# Altium schematic sheet [05]_Control Panel Items Sheet.SchDoc
size 508 x 279 mm; DocumentNumber: 5; SheetNumber: 5; SheetTotal: 5
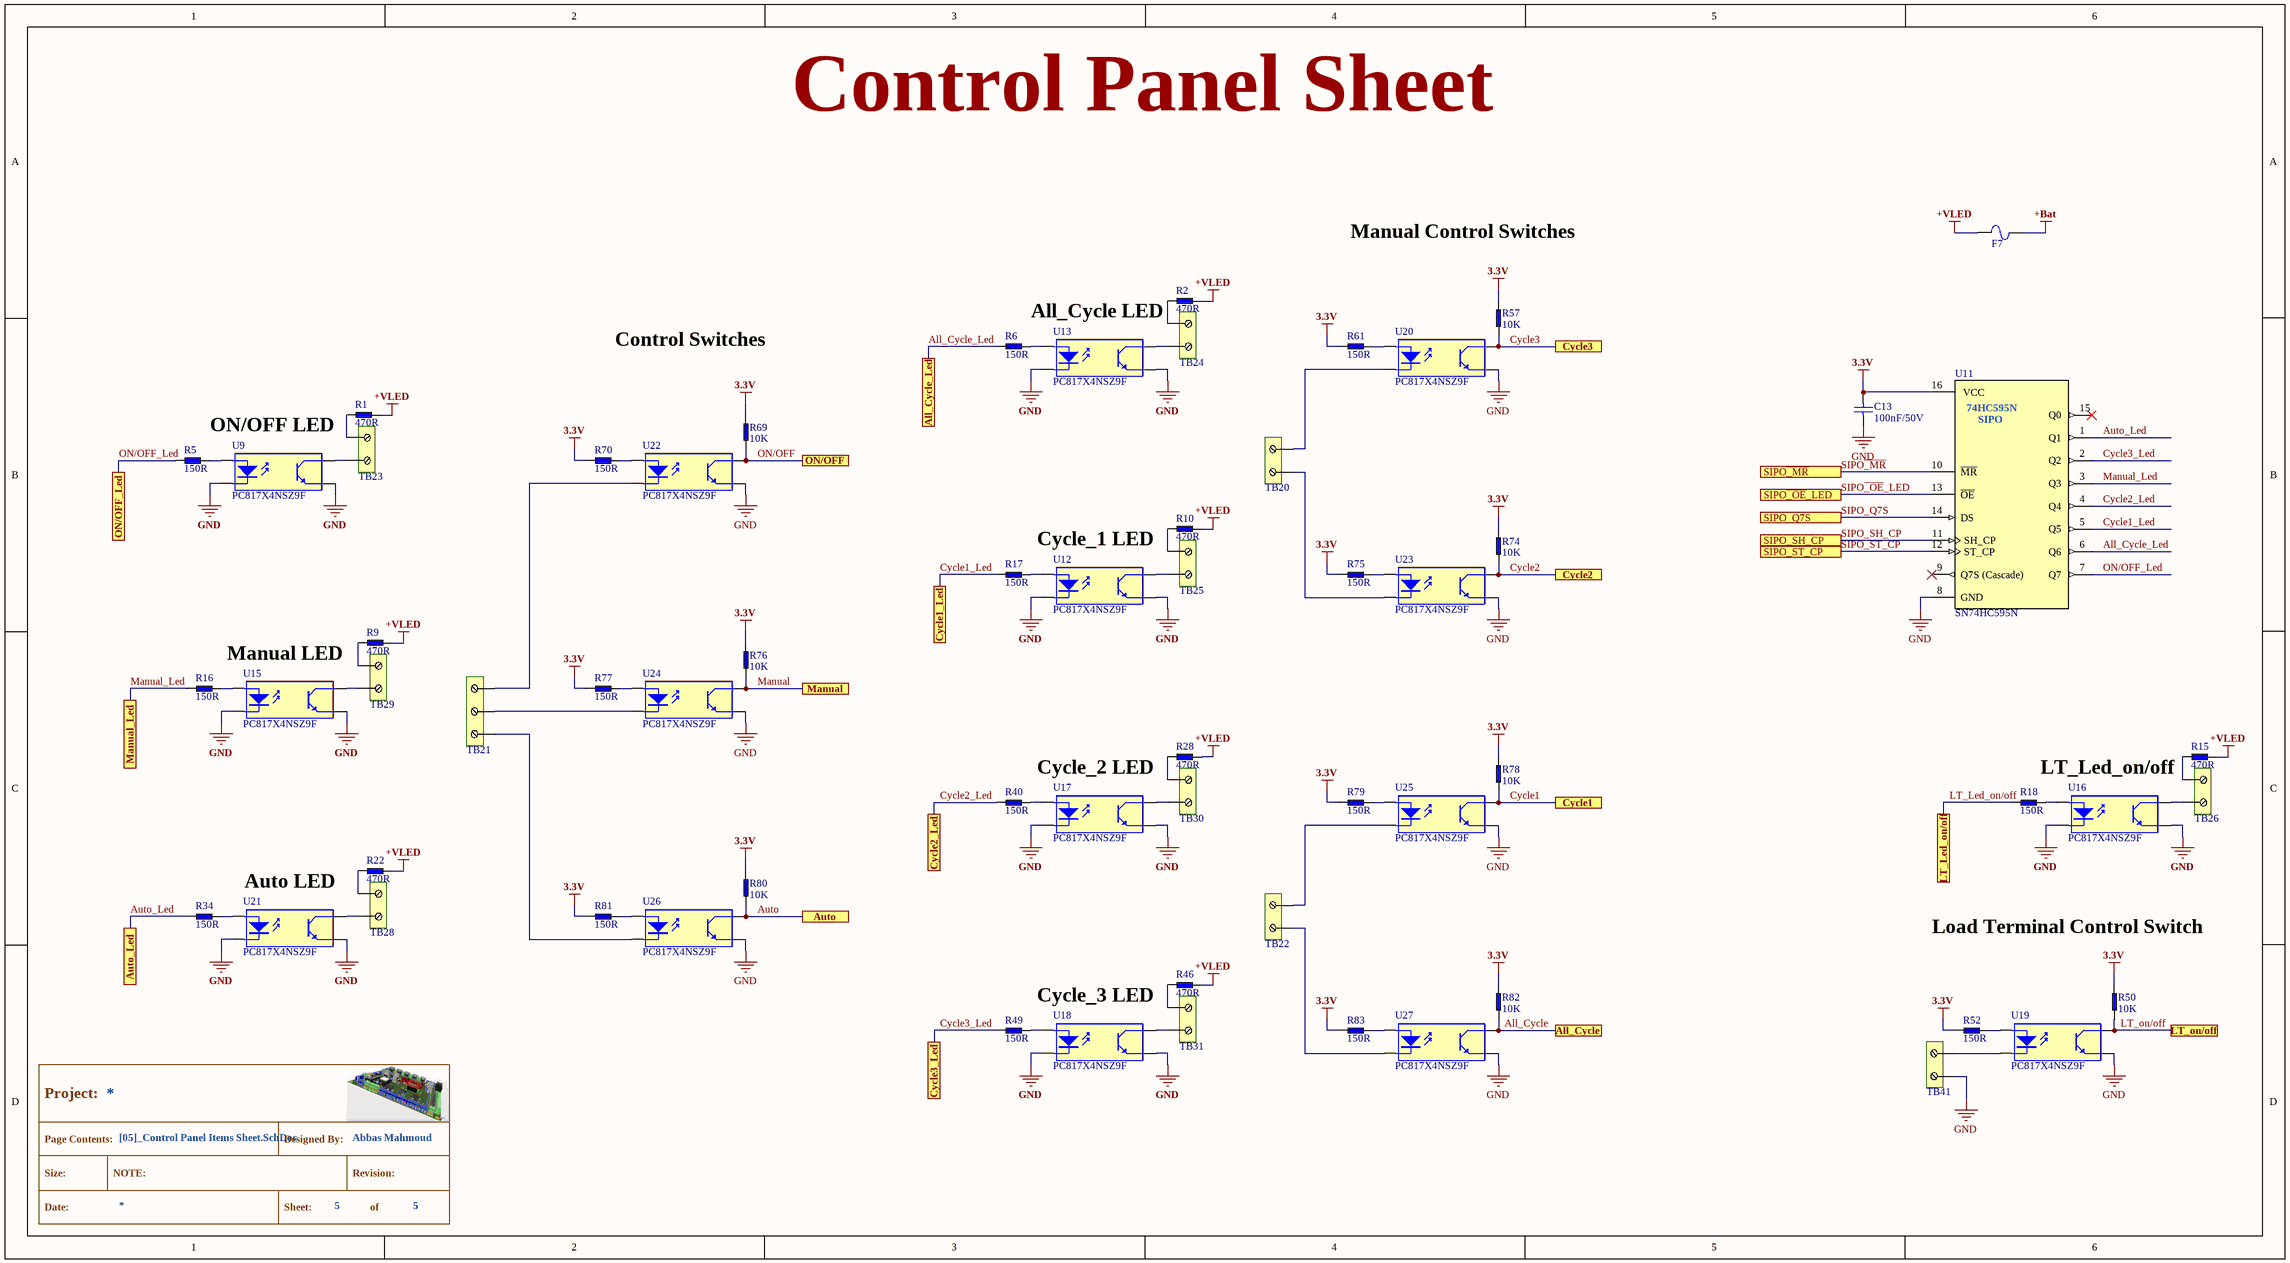
[diagram p0: [05]_Control Panel Items Sheet.SchDoc]

## Parts
*  Title Block  (value not drawn)  (graphical)
C13  100nF/50V  [CCAP - PACKAGE - THT ,P = 2.54 MM]
F7  FUSES&HOLDERS  [FUSE-BLX-A HOLDER]  (value not drawn)
R1  470R  [R - THT - P5.0 - 1/4W]
R2  470R  [R - THT - P5.0 - 1/4W]
R5  150R  [R - THT - P5.0 - 1/4W]
R6  150R  [R - THT - P5.0 - 1/4W]
R9  470R  [R - THT - P5.0 - 1/4W]
R10  470R  [R - THT - P5.0 - 1/4W]
R15  470R  [R - THT - P5.0 - 1/4W]
R16  150R  [R - THT - P5.0 - 1/4W]
R17  150R  [R - THT - P5.0 - 1/4W]
R18  150R  [R - THT - P5.0 - 1/4W]
R22  470R  [R - THT - P5.0 - 1/4W]
R28  470R  [R - THT - P5.0 - 1/4W]
R34  150R  [R - THT - P5.0 - 1/4W]
R40  150R  [R - THT - P5.0 - 1/4W]
R46  470R  [R - THT - P5.0 - 1/4W]
R49  150R  [R - THT - P5.0 - 1/4W]
R50  10K  [R - THT - P5.0 - 1/4W]
R52  150R  [R - THT - P5.0 - 1/4W]
R57  10K  [R - THT - P5.0 - 1/4W]
R61  150R  [R - THT - P5.0 - 1/4W]
R69  10K  [R - THT - P5.0 - 1/4W]
R70  150R  [R - THT - P5.0 - 1/4W]
R74  10K  [R - THT - P5.0 - 1/4W]
R75  150R  [R - THT - P5.0 - 1/4W]
R76  10K  [R - THT - P5.0 - 1/4W]
R77  150R  [R - THT - P5.0 - 1/4W]
R78  10K  [R - THT - P5.0 - 1/4W]
R79  150R  [R - THT - P5.0 - 1/4W]
R80  10K  [R - THT - P5.0 - 1/4W]
R81  150R  [R - THT - P5.0 - 1/4W]
R82  10K  [R - THT - P5.0 - 1/4W]
R83  150R  [R - THT - P5.0 - 1/4W]
TB20  2 Pins Pluggable  [TERMINAL BLOCK - 2 PINS - PACKAGE - PLUGGABLE - THT - P = 5.08MM - Horizontal _ Plug+Receptable]  (value not drawn)
TB21  3 Pins Pluggable  [TERMINAL BLOCK - 3 PINS - PACKAGE - PLUGGABLE - THT - P = 5.08MM - HORIZONTAL _ PLUG+RECEPTABLE]  (value not drawn)
TB22  2 Pins Pluggable  [TERMINAL BLOCK - 2 PINS - PACKAGE - PLUGGABLE - THT - P = 5.08MM - Horizontal _ Plug+Receptable]  (value not drawn)
TB23  2 Pins Pluggable  [TERMINAL BLOCK - 2 PINS - PACKAGE - PLUGGABLE - THT - P = 5.08MM - Horizontal _ Plug+Receptable]  (value not drawn)
TB24  2 Pins Pluggable  [TERMINAL BLOCK - 2 PINS - PACKAGE - PLUGGABLE - THT - P = 5.08MM - Horizontal _ Plug+Receptable]  (value not drawn)
TB25  2 Pins Pluggable  [TERMINAL BLOCK - 2 PINS - PACKAGE - PLUGGABLE - THT - P = 5.08MM - Horizontal _ Plug+Receptable]  (value not drawn)
TB26  2 Pins Pluggable  [TERMINAL BLOCK - 2 PINS - PACKAGE - PLUGGABLE - THT - P = 5.08MM - Horizontal _ Plug+Receptable]  (value not drawn)
TB28  2 Pins Pluggable  [TERMINAL BLOCK - 2 PINS - PACKAGE - PLUGGABLE - THT - P = 5.08MM - Horizontal _ Plug+Receptable]  (value not drawn)
TB29  2 Pins Pluggable  [TERMINAL BLOCK - 2 PINS - PACKAGE - PLUGGABLE - THT - P = 5.08MM - Horizontal _ Plug+Receptable]  (value not drawn)
TB30  2 Pins Pluggable  [TERMINAL BLOCK - 2 PINS - PACKAGE - PLUGGABLE - THT - P = 5.08MM - Horizontal _ Plug+Receptable]  (value not drawn)
TB31  2 Pins Pluggable  [TERMINAL BLOCK - 2 PINS - PACKAGE - PLUGGABLE - THT - P = 5.08MM - Horizontal _ Plug+Receptable]  (value not drawn)
TB41  2 Pins Pluggable  [TERMINAL BLOCK - 2 PINS - PACKAGE - PLUGGABLE - THT - P = 5.08MM - Horizontal _ Plug+Receptable]  (value not drawn)
U9  PC817X4NSZ9F  [ICB - DIP-4]
U11  SN74HC595N  [ICB - DIP-16]
U12  PC817X4NSZ9F  [ICB - DIP-4]
U13  PC817X4NSZ9F  [ICB - DIP-4]
U15  PC817X4NSZ9F  [ICB - DIP-4]
U16  PC817X4NSZ9F  [ICB - DIP-4]
U17  PC817X4NSZ9F  [ICB - DIP-4]
U18  PC817X4NSZ9F  [ICB - DIP-4]
U19  PC817X4NSZ9F  [ICB - DIP-4]
U20  PC817X4NSZ9F  [ICB - DIP-4]
U21  PC817X4NSZ9F  [ICB - DIP-4]
U22  PC817X4NSZ9F  [ICB - DIP-4]
U23  PC817X4NSZ9F  [ICB - DIP-4]
U24  PC817X4NSZ9F  [ICB - DIP-4]
U25  PC817X4NSZ9F  [ICB - DIP-4]
U26  PC817X4NSZ9F  [ICB - DIP-4]
U27  PC817X4NSZ9F  [ICB - DIP-4]

## Ports
All_Cycle, All_Cycle_Led, Auto, Auto_Led, Cycle1, Cycle1_Led, Cycle2, Cycle2_Led, Cycle3, Cycle3_Led, LT_Led_on/off, LT_on/off, Manual, Manual_Led, ON/OFF, ON/OFF_Led, SIPO_Q7S, SIPO_SH_CP, SIPO_ST_CP, SIPO~{_MR}, SIPO~{_OE}_LED

## Nets
3.3V: C13.1 R50.2 R52.1 R57.2 R61.1 R69.2 R70.1 R74.2 R75.1 R76.2 R77.1 R78.2 R79.1 R80.2 R81.1 R82.2 R83.1 U11.16(VCC)
+Bat: F7.2
+VLED: F7.1 R1.2 R2.2 R9.2 R10.2 R15.2 R22.2 R28.2 R46.2
GND: C13.2 TB41.1 U9.2(K) U9.3(E) U11.8(GND) U12.2(K) U12.3(E) U13.2(K) U13.3(E) U15.2(K) U15.3(E) U16.2(K) U16.3(E) U17.2(K) U17.3(E) U18.2(K) U18.3(E) U19.3(E) U20.3(E) U21.2(K) U21.3(E) U22.3(E) U23.3(E) U24.3(E) U25.3(E) U26.3(E) U27.3(E)
All_Cycle: R82.1 U27.4(C) ; port All_Cycle
All_Cycle_Led: R6.1 U11.6(Q6) ; port All_Cycle_Led
Auto: R80.1 U26.4(C) ; port Auto
Auto_Led: R34.1 U11.1(Q1) ; port Auto_Led
Cycle1: R78.1 U25.4(C) ; port Cycle1
Cycle1_Led: R17.1 U11.5(Q5) ; port Cycle1_Led
Cycle2: R74.1 U23.4(C) ; port Cycle2
Cycle2_Led: R40.1 U11.4(Q4) ; port Cycle2_Led
Cycle3: R57.1 U20.4(C) ; port Cycle3
Cycle3_Led: R49.1 U11.2(Q2) ; port Cycle3_Led
LT_Led_on/off: R18.1 ; port LT_Led_on/off
LT_on/off: R50.1 U19.4(C) ; port LT_on/off
Manual: R76.1 U24.4(C) ; port Manual
Manual_Led: R16.1 U11.3(Q3) ; port Manual_Led
ON/OFF: R69.1 U22.4(C) ; port ON/OFF
ON/OFF_Led: R5.1 U11.7(Q7) ; port ON/OFF_Led
SIPO~{_MR}: U11.10(~{MR}) ; port SIPO~{_MR}
SIPO~{_OE}_LED: U11.13(~{OE}) ; port SIPO~{_OE}_LED
SIPO_Q7S: U11.14(DS) ; port SIPO_Q7S
SIPO_SH_CP: U11.11(SH_CP) ; port SIPO_SH_CP
SIPO_ST_CP: U11.12(ST_CP) ; port SIPO_ST_CP
NetR1_1: R1.1 TB23.2
NetR2_1: R2.1 TB24.2
NetR5_2: R5.2 U9.1(A)
NetR6_2: R6.2 U13.1(A)
NetR9_1: R9.1 TB29.2
NetR10_1: R10.1 TB25.2
NetR15_1: R15.1 TB26.2
NetR16_2: R16.2 U15.1(A)
NetR17_2: R17.2 U12.1(A)
NetR18_2: R18.2 U16.1(A)
NetR22_1: R22.1 TB28.2
NetR28_1: R28.1 TB30.2
NetR34_2: R34.2 U21.1(A)
NetR40_2: R40.2 U17.1(A)
NetR46_1: R46.1 TB31.2
NetR49_2: R49.2 U18.1(A)
NetR52_2: R52.2 U19.1(A)
NetR61_2: R61.2 U20.1(A)
NetR70_2: R70.2 U22.1(A)
NetR75_2: R75.2 U23.1(A)
NetR77_2: R77.2 U24.1(A)
NetR79_2: R79.2 U25.1(A)
NetR81_2: R81.2 U26.1(A)
NetR83_2: R83.2 U27.1(A)
NetTB20_1: TB20.1 U23.2(K)
NetTB20_2: TB20.2 U20.2(K)
NetTB21_1: TB21.1 U26.2(K)
NetTB21_2: TB21.2 U24.2(K)
NetTB21_3: TB21.3 U22.2(K)
NetTB22_1: TB22.1 U27.2(K)
NetTB22_2: TB22.2 U25.2(K)
NetTB23_1: TB23.1 U9.4(C)
NetTB24_1: TB24.1 U13.4(C)
NetTB25_1: TB25.1 U12.4(C)
NetTB26_1: TB26.1 U16.4(C)
NetTB28_1: TB28.1 U21.4(C)
NetTB29_1: TB29.1 U15.4(C)
NetTB30_1: TB30.1 U17.4(C)
NetTB31_1: TB31.1 U18.4(C)
NetTB41_2: TB41.2 U19.2(K)

Not connected (* = marked no-connect by the designer): U11 9(Q7S_(Cascade))* 15(Q0)*

## Notes on the sheet
- Control Panel Sheet
- Manual Control Switches
- Control Switches
- All_Cycle LED
- ON/OFF LED
- Cycle_1 LED
- Manual LED
- Cycle_2 LED
- LT_Led_on/off
- (near U21) Auto LED
- Load Terminal Control Switch
- Cycle_3 LED
- (in symbol IC - SN74HC595N) 74HC595N; SIPO
- (in symbol Title Block) Project:; Page Contents:; Designed By:; Abbas Mahmoud; Size:; NOTE:; Revision:; Date:; Sheet:; of

## Library data of the parts
* = Title Block: Moatley Title Block
C13 = CCAP - 100nF - 50V - THT - P = 2.54: 100nF -20%~+80% 50V Through Hole,P=2.54mm Ceramic Disc Capacitors RoHS; Parameter 1: *; Parameter 2: *; Parameter 3: *
R1 R2 R9 R10 R15 R22 R28 R46 = R470R - THT: 470R ±1% 1/4W ±100ppm/℃ Axial Metal Film Resistor_ Throuh Hole Technology RoHS
R5 R6 R16-R18 R34 R40 R49 R52 R61 R70 R75 R77 R79 R81 R83 = R150R - THT: 150R ±1% 1/4W ±100ppm/℃ Axial Metal Film Resistor_ Throuh Hole Technology RoHS
R50 R57 R69 R74 R76 R78 R80 R82 = R10K - THT: 10K ±1% 1/4W ±100ppm/℃ Axial Metal Film Resistor_ Throuh Hole Technology RoHS
TB20 TB22-TB26 TB28-TB31 TB41 = Terminal Block - 2 Pins - Pluggable: Terminal Block 2 Pin 15A 300V  (28-14 AWG) P=5.08mm Through Hole Pluggable System Terminal Block RoHS
TB21 = Terminal Block - 3 Pins - Pluggable: Terminal Block 3 Pin 15A 300V  (28-14 AWG) P=5.08mm Through Hole Pluggable System Terminal Block RoHS
U9 U12 U13 U15-U27 = IC - PC817X4NSZ9F: Optoisolator Transistor Output 5000Vrms 1 Channel 4-DIP; Manufacturer: Sharp Microelectronics; Mfr.Part #: PC817X4NSZ9F; Package: DIP-4
U11 = IC - SN74HC595N: Serial to Parallel or Serial Shift Register Supplementary type DIP-16 Shift Registers RoHS; Manufacturer: Texas Instruments; Mfr.Part #: SN74HC595N; Package: DIP-16